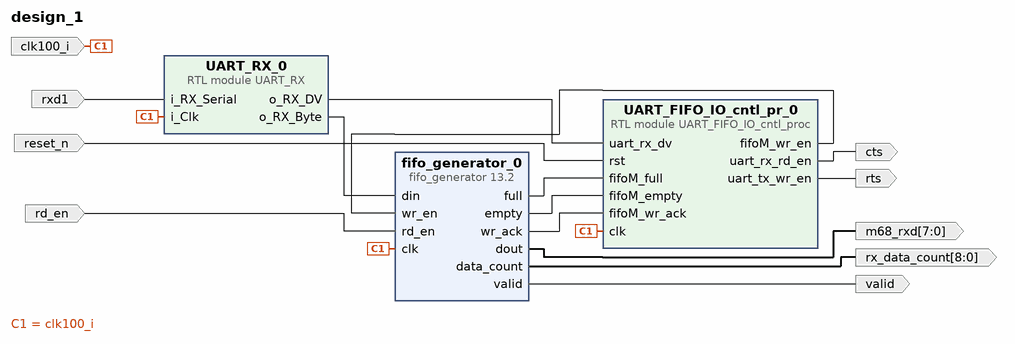
[diagram p0: block diagram of the top level]
# Vivado block design design_1, xc7a100tcsg324-1, Vivado 2020.1
create_bd_design design_1

create_bd_port -dir I rxd1
create_bd_port -dir O -from 7 -to 0 m68_rxd
create_bd_port -dir I -type rst reset_n
create_bd_port -dir O cts
create_bd_port -dir O rts
create_bd_port -dir I rd_en
create_bd_port -dir I -type clk clk100_i
create_bd_port -dir O valid
create_bd_port -dir O -from 8 -to 0 rx_data_count

create_bd_cell -type ip -vlnv xilinx.com:ip:fifo_generator:13.2 fifo_generator_0
set_property -dict [list \
  CONFIG.Data_Count true \
  CONFIG.Data_Count_Width 9 \
  CONFIG.Fifo_Implementation Common_Clock_Block_RAM \
  CONFIG.Input_Data_Width 8 \
  CONFIG.Input_Depth 512 \
  CONFIG.Output_Data_Width 8 \
  CONFIG.Overflow_Flag false \
  CONFIG.Programmable_Empty_Type No_Programmable_Empty_Threshold \
  CONFIG.Reset_Pin false \
  CONFIG.Underflow_Flag false \
  CONFIG.Use_Embedded_Registers false \
  CONFIG.Valid_Flag true \
  CONFIG.Write_Acknowledge_Flag true \
] [get_bd_cells fifo_generator_0]
create_bd_cell -type module -reference UART_RX UART_RX_0
create_bd_cell -type module -reference UART_FIFO_IO_cntl_proc UART_FIFO_IO_cntl_pr_0

# ---- connections ----

connect_bd_net -net clk_wiz_0_clk_out1 [get_bd_ports clk100_i] \
  [get_bd_pins UART_RX_0/i_Clk] [get_bd_pins fifo_generator_0/clk] [get_bd_pins UART_FIFO_IO_cntl_pr_0/clk]
connect_bd_net [get_bd_pins fifo_generator_0/dout] [get_bd_ports m68_rxd]
connect_bd_net [get_bd_ports reset_n] [get_bd_pins UART_FIFO_IO_cntl_pr_0/rst]
connect_bd_net -net rxd1_1 [get_bd_ports rxd1] [get_bd_pins UART_RX_0/i_RX_Serial]
connect_bd_net [get_bd_pins UART_RX_0/o_RX_Byte] [get_bd_pins fifo_generator_0/din]
connect_bd_net [get_bd_pins UART_RX_0/o_RX_DV] [get_bd_pins UART_FIFO_IO_cntl_pr_0/uart_rx_dv]
connect_bd_net [get_bd_pins fifo_generator_0/full] [get_bd_pins UART_FIFO_IO_cntl_pr_0/fifoM_full]
connect_bd_net [get_bd_pins fifo_generator_0/empty] [get_bd_pins UART_FIFO_IO_cntl_pr_0/fifoM_empty]
connect_bd_net [get_bd_pins UART_FIFO_IO_cntl_pr_0/fifoM_wr_en] [get_bd_pins fifo_generator_0/wr_en]
connect_bd_net [get_bd_pins fifo_generator_0/wr_ack] [get_bd_pins UART_FIFO_IO_cntl_pr_0/fifoM_wr_ack]
connect_bd_net [get_bd_pins UART_FIFO_IO_cntl_pr_0/uart_rx_rd_en] [get_bd_ports cts]
connect_bd_net [get_bd_pins UART_FIFO_IO_cntl_pr_0/uart_tx_wr_en] [get_bd_ports rts]
connect_bd_net -net rd_en_0_1 [get_bd_ports rd_en] [get_bd_pins fifo_generator_0/rd_en]
connect_bd_net [get_bd_pins fifo_generator_0/valid] [get_bd_ports valid]
connect_bd_net [get_bd_pins fifo_generator_0/data_count] [get_bd_ports rx_data_count]

validate_bd_design
save_bd_design
